# EAGLE design MCLab_DRV293_1.1 (EAGLE 4.15)
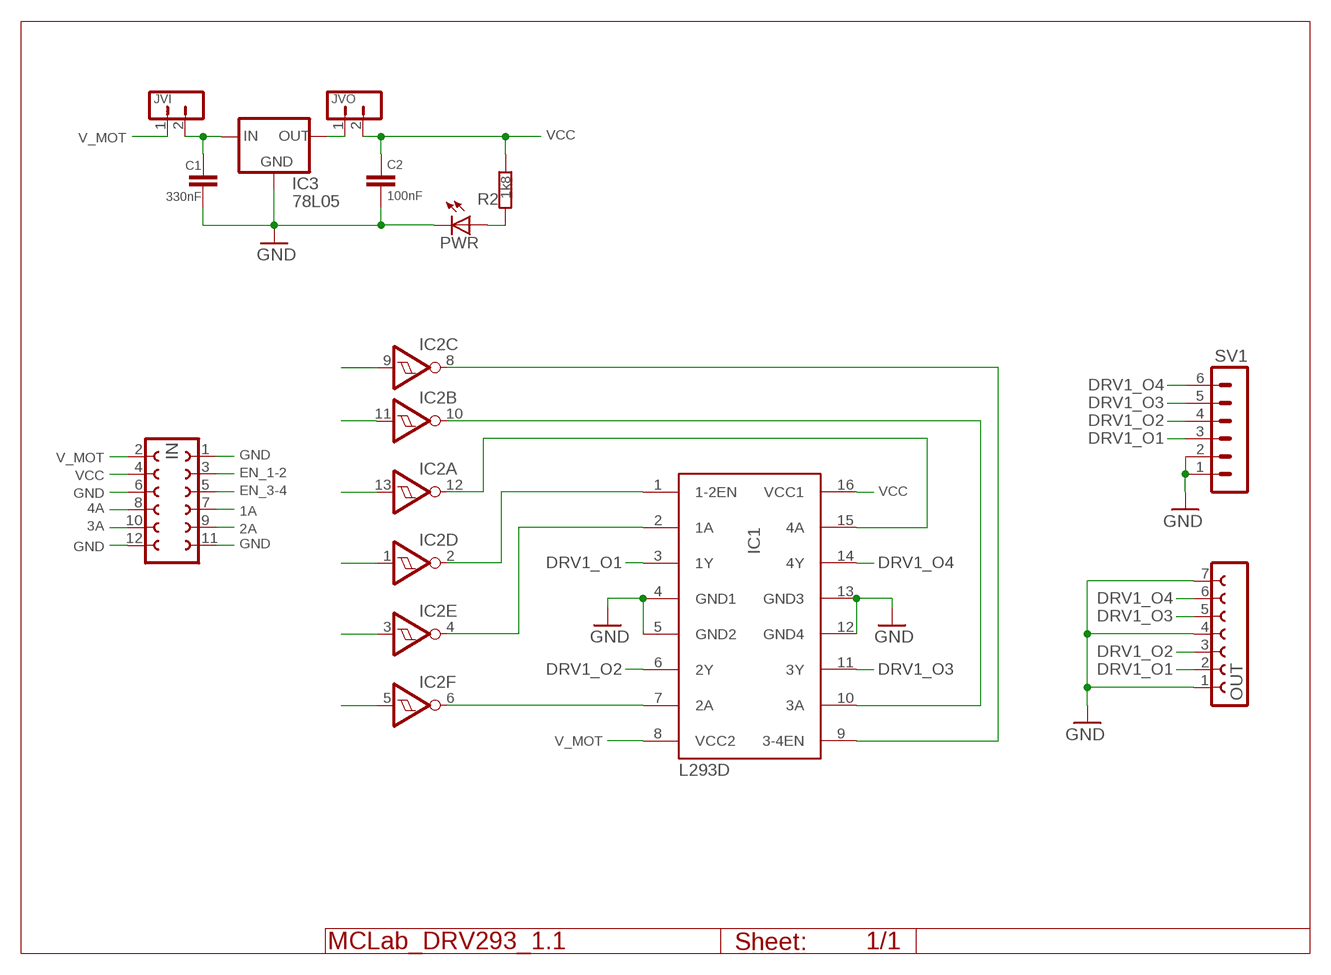
[diagram p0: schematic, sheet 1]

## Parts
C1  330nF  C-EU025-024X044  [C025-024X044]
C2  100nF  C-EU025-024X044  [C025-024X044]
IC1  L293D  [DIL16]
IC2  74HCT14N  [DIL14]
IC3  78L05  78LXX  [78LXX]
IN  HD_F06X2  [HD_F06X2]
JVI  HD_M02X1_R  [HD_M02X1R]
JVO  HD_M02X1_R  [HD_M02X1R]
OUT  HD_F07X1  [HD_F07X1]
PWR  LED3MM  [LED3MM]
R2  1k8  R-EU_0207/10  [0207/10]
SV1  HD_M06X1  [HD_M06X1]

## Nets
1A: IC2.3(E:I) IN.7
1A_I: IC1.2(1A) IC2.4(E:O)
2A: IC2.5(F:I) IN.9
2A_I: IC1.7(2A) IC2.6(F:O)
3A: IC2.11(B:I) IN.10
3A_I: IC1.10(3A) IC2.10(B:O)
4A: IC2.13(A:I) IN.8
4A_I: IC1.15(4A) IC2.12(A:O)
DRV1_O1: IC1.3(1Y) OUT.2 SV1.3
DRV1_O2: IC1.6(2Y) OUT.3 SV1.4
DRV1_O3: IC1.11(3Y) OUT.5 SV1.5
DRV1_O4: IC1.14(4Y) OUT.6 SV1.6
EN_1-2: IC2.1(D:I) IN.3
EN_1-2_I: IC1.1(1-2EN) IC2.2(D:O)
EN_3-4: IC2.9(C:I) IN.5
EN_3-4_I: IC1.9(3-4EN) IC2.8(C:O)
GND: C1.1 C2.1 IC1.4(GND1) IC1.5(GND2) IC1.12(GND4) IC1.13(GND3) IC3.GND IN.1 IN.6 IN.11 IN.12 OUT.1 OUT.4 OUT.7 PWR.K(C) SV1.1 SV1.2
N$1: IC3.OUT JVO.1
N$2: C1.2 IC3.IN JVI.2
N$8: PWR.A R2.2
V_MOT: IC1.8(VCC2) IN.2 JVI.1
VCC: C2.2 IC1.16(VCC1) IN.4 JVO.2 R2.1

## Power pins joined to a net without a drawn wire
GND: IC2.7(P:GND)
VCC: IC2.14(P:VCC)

## Library data of the parts
C1 C2 = rcl:C-EU: CAPACITOR, European symbol
IC1 = st-microelectronics:L293D: PUSH-PULL 4 CHANNEL DRIVER
IC2 = mc-logic:74*14: Hex schmitt trigger INVERTER
IC3 = mc-active:78LXX: VOLTAGE REGULATOR
IN = mc_connectors:HD_F06X2
JVI JVO = mc_connectors:HD_M02X1
OUT = mc_connectors:HD_F07X1
PWR = led:LED: LED OSRAM: - CHIPLED LG R971, LG N971, LY N971, LG Q971, LY Q971, LO R971, LY R971 LH N974, LH R974 LS Q976, LO Q976, LY Q976 LO Q996 - Hyper CHIPLED LW Q18S LB Q993, LB Q99A, LB R99A - SideLED LS A670, LO A670, LY A670, LG A670, LP A670 LB A673, LV A673, LT A673, LW A673 LH A674 LY A675 LS A676, LA A676, LO A676, LY A676, LW A676 LS A679, LY A679, LG A679 - Hyper Micro SIDELED® LS Y876, LA Y876, LO Y876, LY Y876 LT Y87S - SmartLED LW L88C, LW L88S LB L89C, LB L89S, LG L890 LS L89K, LO L89K, LY L89K LS L896, LA L896, LO L896, LY L896 - TOPLED LS T670, LO T670, LY T670, LG T670, LP T670 LSG T670, LSP T670, LSY T670, LOP T670, LYG T670 LG T671, LOG T671, LSG T671 LB T673, LV T673, LT T673, LW T673 LH T674 LS T676, LA T676, LO T676, LY T676, LB T676, LH T676, LSB T676, LW T676 LB T67C, LV T67C, LT T67C, LS T67K, LO T67K, LY T67K, LW E67C LS E67B, LA E67B, LO E67B, LY E67B, LB E67C, LV E67C, LT E67C LW T67C LS T679, LY T679, LG T679 LS T770, LO T770, LY T770, LG T770, LP T770 LB T773, LV T773, LT T773, LW T773 LH T774 LS E675, LA E675, LY E675, LS T675 LS T776, LA T776, LO T776, LY T776, LB T776 LHGB T686 LT T68C, LB T68C - Hyper Mini TOPLED® LB M676 - Mini TOPLED Santana® LG M470 LS M47K, LO M47K, LY M47K Source: http://www.osram.convergy.de/
R2 = rcl:R-EU_: RESISTOR, European symbol
SV1 = mc_connectors:HD_M06X1: PIN HEADER

## Board
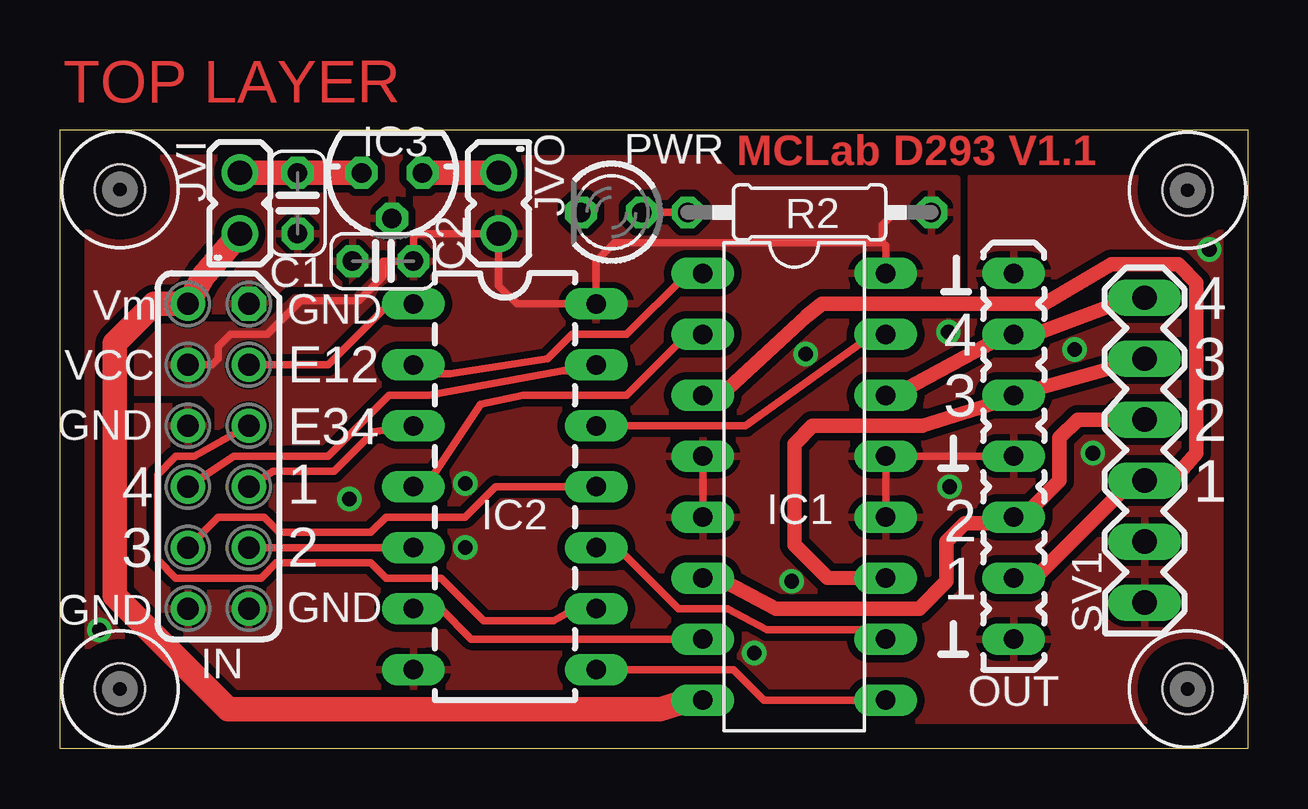
[diagram p1: board, top side]
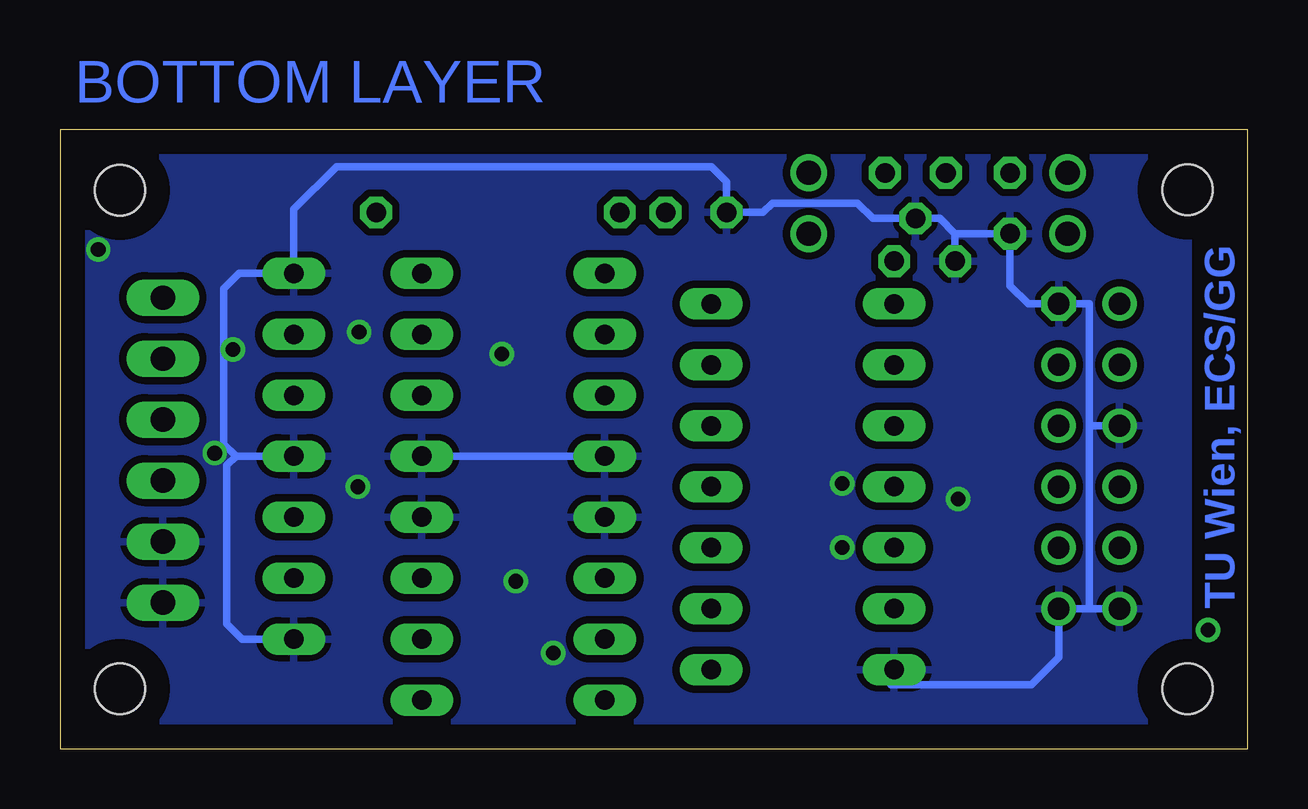
[diagram p2: board, bottom side, seen from below]

Size 49.5 x 25.8 mm. Coordinates in mm from the lower left corner, seen from the top.
Outline: 0,0 0,25.8 49.5,25.8 49.5,0 0,0
Copper layers (1*16): Top 0.035mm / dielectric 1.5mm / Bottom 0.035mm
Design rules "Olimex_11mils": minimum track width 11mil, minimum drill 24mil, track to track 11mil, track to pad 11mil, pad to pad 11mil, via to via 11mil, smd to smd 11mil, copper to edge 40mil, drill to drill 11mil, minimum pad ring 10mil, minimum via ring 8mil, stop-mask expansion 0mil, vias tented up to drill 0mil, thermal gap 10mil

### Footprints (pad centres in the part's own frame; a part is rotated, then mirrored left to right if it is on the bottom)
C025-024X044 = drill 0.813 octagon: 1 -1.27,0; 2 1.27,0
DIL16 = drill 0.813 long: 1 -8.89,-3.81; 2 -6.35,-3.81; 3 -3.81,-3.81; 4 -1.27,-3.81; 5 1.27,-3.81; 6 3.81,-3.81; 7 6.35,-3.81; 8 8.89,-3.81; 9 8.89,3.81; 10 6.35,3.81; 11 3.81,3.81; 12 1.27,3.81; 13 -1.27,3.81; 14 -3.81,3.81; 15 -6.35,3.81; 16 -8.89,3.81
DIL14 = drill 0.813 long: 1 -7.62,-3.81; 2 -5.08,-3.81; 3 -2.54,-3.81; 4 0,-3.81; 5 2.54,-3.81; 6 5.08,-3.81; 7 7.62,-3.81; 8 7.62,3.81; 9 5.08,3.81; 10 2.54,3.81; 11 0,3.81; 12 -2.54,3.81; 13 -5.08,3.81; 14 -7.62,3.81
78LXX = drill 0.813 octagon: GND 0,1.905; IN 1.27,0; OUT -1.27,0
HD_F06X2 = drill 0.914 octagon: 1 -6.35,1.27 | drill 0.914 round: 2 -6.35,-1.27; 3 -3.81,1.27; 4 -3.81,-1.27; 5 -1.27,1.27; 6 -1.27,-1.27; 7 1.27,1.27; 8 1.27,-1.27; 9 3.81,1.27; 10 3.81,-1.27; 11 6.35,1.27; 12 6.35,-1.27
HD_M02X1R = drill 1.016 round: 1 -1.27,0; 2 1.27,0
HD_F07X1 = drill 0.813 long: 1 -7.62,0; 2 -5.08,0; 3 -2.54,0; 4 0,0; 5 2.54,0; 6 5.08,0; 7 7.62,0
LED3MM = drill 0.813 octagon: A -1.27,0; K 1.27,0
0207/10 = drill 0.813 octagon: 1 -5.08,0; 2 5.08,0
DRIL-2.1 = hole 2.1: 0,0
HD_M06X1 = drill 1.016 long: 1 -6.35,0; 2 -3.81,0; 3 -1.27,0; 4 1.27,0; 5 3.81,0; 6 6.35,0

### Placement (x,y rotation side)
C1  9.91,22.73 90 top
C2  13.46,20.32 0 top
IC1  30.61,10.92 270 top
IC2  18.54,10.92 270 top
IC3  13.84,24 180 top
IN  6.6,12.19 270 top
JVI  7.49,22.73 90 top
JVO  18.29,22.73 270 top
OUT  39.75,12.19 90 top
PWR  22.99,22.35 180 top
R2  31.24,22.35 180 top
SCREW_NE  [DRIL-2.1]  47,23.27 0 top
SCREW_NW  [DRIL-2.1]  2.5,23.3 0 top
SCREW_SE  [DRIL-2.1]  47,2.5 0 top
SCREW_SW  [DRIL-2.1]  2.5,2.5 0 top
SV1  45.21,12.45 90 top

### Tracks (layer width: path | path; a pad name or v marks a point on that pad's centre or on a via)
1A
  Top 0.305: IN.7 8.89,11.56 11.43,11.56 13.08,13.21 IC2.3
1A_I
  Top 0.305: IC1.2 26.05,17.16 23.62,14.73 19.3,14.73 17.53,14.35 15.49,11.3 IC2.4
2A
  Top 0.305: IN.9 IC2.5
2A_I
  Top 0.305: IC2.6 15.88,5.84 17.14,4.57 IC1.7
3A
  Top 0.305: IN.10 6.6,9.65 8.51,9.65 9.14,9.02 12.95,9.02 13.59,9.65 16.89,9.65 18.16,10.92 IC2.11
3A_I
  Top 0.305: IC2.10 23.24,8.38 25.78,5.84 27.81,5.84 29.46,4.95 33.53,4.95 33.91,4.57 IC1.10
4A
  Top 0.305: IN.8 7.24,12.19 11.18,12.19 13.72,14.73 15.37,14.73 20.95,15.75 22.1,15.75 IC2.13
4A_I
  Top 0.305: IC1.15 33.91,17.27 28.57,13.46 IC2.12
DRV1_O1
  Top 0.61: IC1.3 27.57,14.75 31.11,18.03 31.75,18.54 41.02,18.54 43.81,20.19 46.61,20.19 47.37,19.43 47.37,12.32 46.35,11.18 SV1.3 44.7,11.18 40.64,7.11 OUT.2
DRV1_O2
  Top 0.61: IC1.6 27.42,7.13 29.84,5.84 35.81,5.84 36.96,6.99 36.96,8.64 37.72,9.4 39.37,9.4 39.62,9.65 OUT.3 40.13,9.65 41.66,11.18 41.66,12.95 42.42,13.72 SV1.4
DRV1_O3
  Top 0.61: IC1.11 31.99,7.13 30.61,8.51 30.61,12.7 31.37,13.46 35.94,13.46 39.62,14.61 OUT.5 SV1.5
DRV1_O4
  Top 0.61: IC1.14 34.67,14.99 35.23,14.99 39.24,17.14 39.62,17.14 OUT.6 40.64,17.27 44.7,18.8 SV1.6
EN_1-2
  Top 0.305: IN.3 11.18,16 13.72,18.54 IC2.1 14.83,18.54
EN_1-2_I
  Top 0.305: IC1.1 26.05,19.7 23.62,17.27 21.34,17.27 20.32,16.26 16.26,15.62 15.11,15.62 IC2.2
EN_3-4
  Top 0.305: IC2.9 21.46,5.84 20.57,5.33 17.65,5.33 15.88,7.11 13.59,7.11 12.95,7.75 9.02,7.75 8.38,7.11 4.83,7.11 4.06,7.87 4.06,11.43 4.83,12.19 5.59,12.19 IN.5
EN_3-4_I
  Top 0.305: IC2.8 28.07,3.3 29.34,2.03 IC1.9
GND  (via drill 0.61)
  Top 0.305: OUT.4 IC1.13 IC1.12 | IC1.4 IC1.5
  Bottom 0.305: 12.19,21.46 12.83,22.1 IC3.GND 15.62,22.1 16.26,22.73 19.81,22.73 20.19,22.35 PWR.K 21.72,23.62 22.35,24.26 37.97,24.26 39.75,22.48 OUT.7 42.04,19.81 42.67,19.18 42.67,12.7 42.16,12.19 | 12.19,21.46 C1.1 9.91,19.3 9.14,18.54 IN.1 6.6,18.54 6.6,13.46 | 6.6,13.46 IN.6 | IN.12 6.6,5.84 | 6.6,5.84 6.6,13.46 | 6.6,5.84 IN.11 7.87,3.81 9.02,2.67 14.86,2.67 14.86,2.66 IC2.7 | OUT.1 41.91,4.57 42.55,5.21 42.55,11.81 42.16,12.19 | 42.16,12.19 OUT.4 | 12.19,21.46 C2.1 | IC1.13 IC1.4
  other vias: 16.89,8.38 16.89,11.05 30.51,6.99 28.93,3.99 47.9,20.8 37.08,10.92 42.29,16.64 43.05,12.32 37.03,17.37 31.09,16.46 12.06,10.41 1.65,4.95
  pour Bottom (isolate 0.305): 2.47,26.72 2.47,-0.8 50.95,-0.8 50.95,26.72
  pour Top (isolate 0.305, rank 2): -1.02,-1.27 0.25,-2.54 48.26,-2.54 50.16,-0.64 50.16,23.75 37.72,23.75 37.72,17.78 31.11,17.78 26.67,13.59 23.37,13.59 21.84,15.11 14.1,15.11 11.05,12.06 6.48,12.06 6.48,14.73 2.67,14.73 2.67,17.53 8.26,17.53 9.78,19.05 12.19,19.05 14.73,21.59 14.73,26.04 0.25,26.04 -1.02,24.77
N$1
  Top 1.016: IC3.OUT JVO.1
N$2
  Top 1.016: JVI.2 C1.2 IC3.IN
N$8
  Top 0.305: PWR.A R2.2
V_MOT
  Top 1.016: JVI.1 5.97,19.68 IN.2 3.94,18.54 2.29,16.89 2.29,6.38 7.01,1.65 25.02,1.65 26.3,2.05 IC1.8
VCC
  Top 0.305: IN.4 6.35,16 6.6,16.26 6.6,16.76 7.11,17.27 8.64,17.27 10.03,18.67 12.45,18.67 13.46,19.68 13.46,20.32 C2.2 14.73,21.34 14.86,21.46 JVO.2 18.29,19.3 19.05,18.54 22.23,18.54 | 22.23,18.54 IC2.14 | 22.23,18.54 22.35,18.67 22.35,20.32 23.11,21.08 34.29,21.08 | 34.29,21.08 34.42,20.95 IC1.16 | 34.29,21.08 34.29,21.84 34.8,22.35 R2.1
  pour Top (isolate 0.305): 16.26,24.89 14.86,23.5 14.86,21.34 12.32,18.8 9.78,18.8 8.64,17.65 3.05,17.65 2.41,17.02 2.41,14.86 5.97,14.86 6.6,14.22 6.6,12.57 7.11,12.06 10.67,12.06 13.84,15.24 22.23,15.24 23.5,13.97 26.54,13.97 31.24,18.41 37.39,18.41 37.39,23.75 28.07,23.75 26.92,24.89

### Text on the board
Top: TOP LAYER | MCLab D293 V1.1
Bottom: BOTTOM LAYER | TU Wien, ECS/GG
tNames: Vm | GND | 4 | 4 | VCC | 3 | E12 | 3 | GND | E34 | 2 | 4 | 1 | 2 | 1 | 3 | 2 | 1 | GND | GND